# Altium schematic sheet Sheet1.SchDoc
size A; SheetNumber: 1; SheetTotal: 1
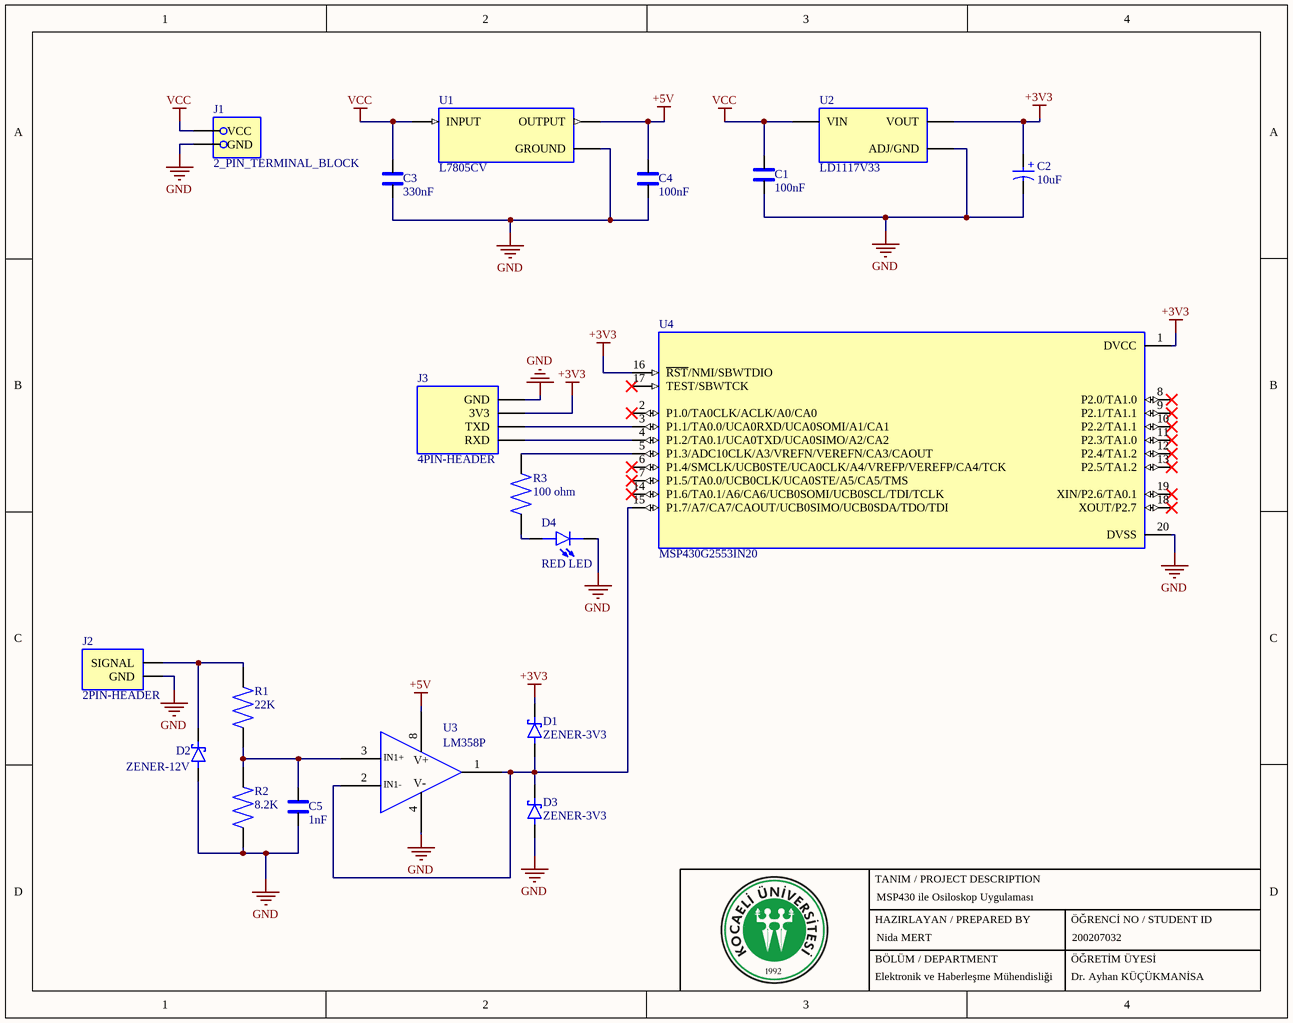
[diagram p0: Sheet1.SchDoc]

## Parts
C1  100nF  [5MM-CAPACITOR-UNIPOLAR]
C2  10uF  [5mm_Capacitor]
C3  330nF  [5MM-CAPACITOR-UNIPOLAR]
C4  100nF  [5MM-CAPACITOR-UNIPOLAR]
C5  1nF  [5MM-CAPACITOR-UNIPOLAR]
D1  ZENER-3V3  [ZENER]
D2  ZENER-12V  [ZENER]
D3  ZENER-3V3  [ZENER]
D4  RED LED  [LED]
J1  2_PIN_TERMINAL_BLOCK  [2_PIN_TERMINAL_BLOCK]
J2  2PIN-HEADER  [2PIN-HEADER-2.54mm]
J3  4PIN-HEADER  [4PIN-HEADER-2.54mm]
R1  22K  [7MM_RESISTOR]
R2  8.2K  [7MM_RESISTOR]
R3  100 ohm  [7MM_RESISTOR]
U1  L7805CV  [L7805CV_TO220]
U2  LD1117V33  [LD1117_TO-220AB]
U3  LM358P  [LM358P]
U4  MSP430G2553IN20  [DIP20-TH]

## Nets
+3V3: C2.1(P) D1.1(K) J3.02(3V3) U2.2(VOUT) U4.1(DVCC) U4.16(~{RST}/NMI/SBWTDIO)
+5V: C4.2 U1.3(OUTPUT) U3.8
GND: C1.1 C2.2(N) C3.1 C4.1 C5.1 D2.2(A) D3.2(A) D4.C J1.2(GND) J2.2(GND) J3.01(GND) R2.1 U1.2(GROUND) U2.1(ADJ/GND) U3.4 U4.20(DVSS)
VCC: C1.2 C3.2 J1.1(VCC) U1.1(INPUT) U2.3(VIN)
NetC5_2: C5.2 R1.1 R2.2 U3.3
NetD1_2: D1.2(A) D3.1(K) U3.1 U3.2 U4.15(P1.7/A7/CA7/CAOUT/UCB0SIMO/UCB0SDA/TDO/TDI)
NetD2_1: D2.1(K) J2.1(SIGNAL) R1.2
NetD4_A: D4.A R3.1
NetJ3_03: J3.03(TXD) U4.3(P1.1/TA0.0/UCA0RXD/UCA0SOMI/A1/CA1)
NetJ3_04: J3.04(RXD) U4.4(P1.2/TA0.1/UCA0TXD/UCA0SIMO/A2/CA2)
NetR3_2: R3.2 U4.5(P1.3/ADC10CLK/A3/VREFN/VEREFN/CA3/CAOUT)

Not connected (* = marked no-connect by the designer): U4 2(P1.0/TA0CLK/ACLK/A0/CA0)* 6(P1.4/SMCLK/UCB0STE/UCA0CLK/A4/VREFP/VEREFP/CA4/TCK)* 7(P1.5/TA0.0/UCB0CLK/UCA0STE/A5/CA5/TMS)* 8(P2.0/TA1.0)* 9(P2.1/TA1.1)* 10(P2.2/TA1.1)* 11(P2.3/TA1.0)* 12(P2.4/TA1.2)* 13(P2.5/TA1.2)* 14(P1.6/TA0.1/A6/CA6/UCB0SOMI/UCB0SCL/TDI/TCLK)* 17(TEST/SBWTCK)* 18(XOUT/P2.7)* 19(XIN/P2.6/TA0.1)*

## Notes on the sheet
- TANIM / PROJECT DESCRIPTION
- MSP430 ile Osiloskop Uygulaması
- HAZIRLAYAN / PREPARED BY
- BÖLÜM / DEPARTMENT
- Nida MERT
- ÖĞRETİM ÜYESİ
- ÖĞRENCİ NO / STUDENT ID
- 200207032
- Elektronik ve Haberleşme Mühendisliği
- Dr. Ayhan KÜÇÜKMANİSA
- (in symbol Capacitor) +
- (in symbol LM358P) IN1+; V+; IN1-; V-

## Library data of the parts
C1 C3-C5 = Capacitor-Unipolar
C2 = Capacitor
D1-D3 = ZENER
D4 = LED
R1-R3 = Resistor